# EAGLE schematic RS232Multiplexer (EAGLE 6.3)

## Sheet 1 of 4
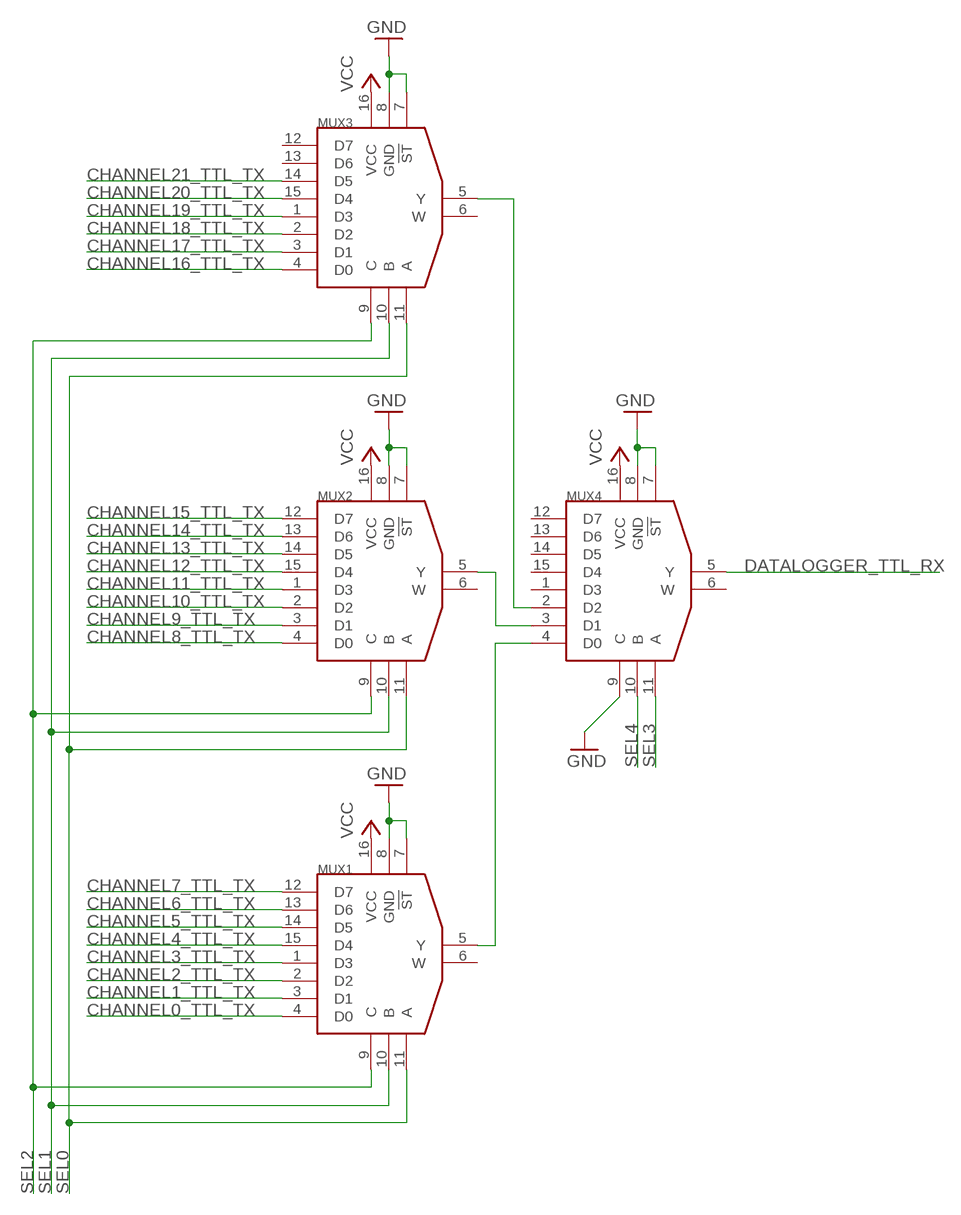
[diagram p0: schematic, sheet 1]

### Parts
MUX1  M74HC251_MULTIPLEXER  [GENERIC16]
MUX2  M74HC251_MULTIPLEXER  [GENERIC16]
MUX3  M74HC251_MULTIPLEXER  [GENERIC16]
MUX4  M74HC251_MULTIPLEXER  [GENERIC16]

### Nets
CHANNEL0_TTL_TX: MUX1.4(D0) ; also sheet 3
CHANNEL1_TTL_TX: MUX1.3(D1) ; also sheet 3
CHANNEL2_TTL_TX: MUX1.2(D2) ; also sheet 4
CHANNEL3_TTL_TX: MUX1.1(D3) ; also sheet 4
CHANNEL4_TTL_TX: MUX1.15(D4) ; also sheet 3
CHANNEL5_TTL_TX: MUX1.14(D5) ; also sheet 3
CHANNEL6_TTL_TX: MUX1.13(D6) ; also sheet 4
CHANNEL7_TTL_TX: MUX1.12(D7) ; also sheet 4
CHANNEL8_TTL_TX: MUX2.4(D0) ; also sheet 3
CHANNEL9_TTL_TX: MUX2.3(D1) ; also sheet 3
CHANNEL10_TTL_TX: MUX2.2(D2) ; also sheet 4
CHANNEL11_TTL_TX: MUX2.1(D3) ; also sheet 4
CHANNEL12_TTL_TX: MUX2.15(D4) ; also sheet 3
CHANNEL13_TTL_TX: MUX2.14(D5) ; also sheet 3
CHANNEL14_TTL_TX: MUX2.13(D6) ; also sheet 4
CHANNEL15_TTL_TX: MUX2.12(D7) ; also sheet 4
CHANNEL16_TTL_TX: MUX3.4(D0) ; also sheet 3
CHANNEL17_TTL_TX: MUX3.3(D1) ; also sheet 3
CHANNEL18_TTL_TX: MUX3.2(D2) ; also sheet 4
CHANNEL19_TTL_TX: MUX3.1(D3) ; also sheet 4
CHANNEL20_TTL_TX: MUX3.15(D4) ; also sheet 3
CHANNEL21_TTL_TX: MUX3.14(D5) ; also sheet 3
DATALOGGER_TTL_RX: MUX4.5(Y) ; also sheet 4
GND: MUX1.7(!ST) MUX1.8(GND) MUX2.7(!ST) MUX2.8(GND) MUX3.7(!ST) MUX3.8(GND) MUX4.7(!ST) MUX4.8(GND) MUX4.9(C) ; also sheet 2,3,4
N$1: MUX2.5(Y) MUX4.3(D1)
N$2: MUX3.5(Y) MUX4.2(D2)
N$10: MUX1.5(Y) MUX4.4(D0)
SEL0: MUX1.11(A) MUX2.11(A) MUX3.11(A) ; also sheet 2
SEL1: MUX1.10(B) MUX2.10(B) MUX3.10(B) ; also sheet 2
SEL2: MUX1.9(C) MUX2.9(C) MUX3.9(C) ; also sheet 2
SEL3: MUX4.11(A) ; also sheet 2
SEL4: MUX4.10(B) ; also sheet 2
VCC: MUX1.16(VCC) MUX2.16(VCC) MUX3.16(VCC) MUX4.16(VCC) ; also sheet 2,3,4
Unconnected: MUX1.6(W) MUX2.6(W) MUX3.6(W) MUX3.12(D7) MUX3.13(D6) MUX4.1(D3) MUX4.6(W) MUX4.12(D7) MUX4.13(D6) MUX4.14(D5) MUX4.15(D4)

## Sheet 2 of 4
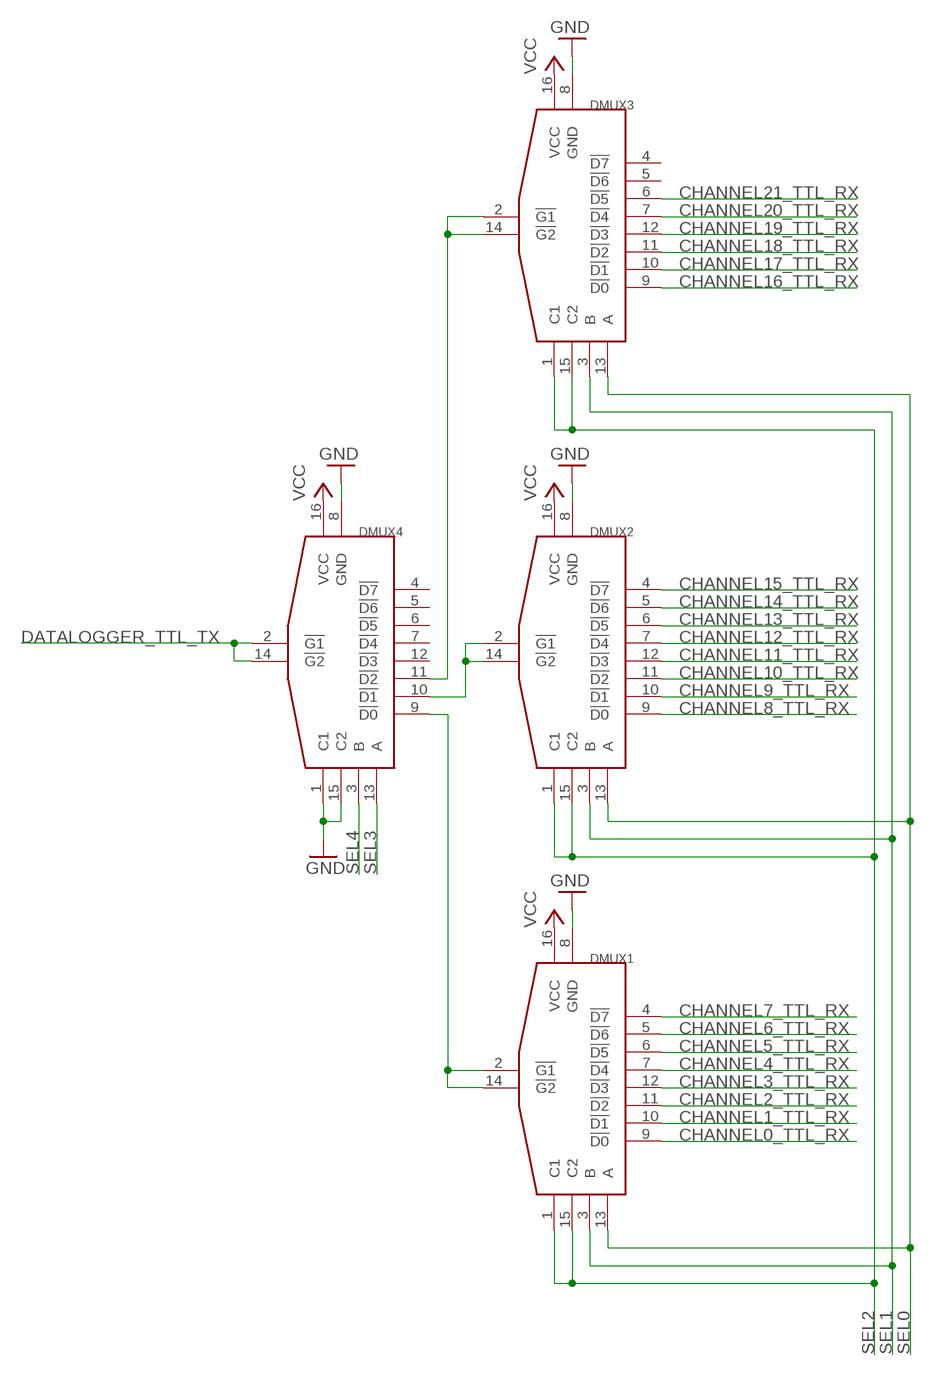
[diagram p1: schematic, sheet 2]

### Parts
DMUX1  SN74LS156_DEMULTIPLEXER  [GENERIC16]
DMUX2  SN74LS156_DEMULTIPLEXER  [GENERIC16]
DMUX3  SN74LS156_DEMULTIPLEXER  [GENERIC16]
DMUX4  SN74LS156_DEMULTIPLEXER  [GENERIC16]

### Nets
CHANNEL0_TTL_RX: DMUX1.9(!D0) ; also sheet 3
CHANNEL1_TTL_RX: DMUX1.10(!D1) ; also sheet 3
CHANNEL2_TTL_RX: DMUX1.11(!D2) ; also sheet 4
CHANNEL3_TTL_RX: DMUX1.12(!D3) ; also sheet 4
CHANNEL4_TTL_RX: DMUX1.7(!D4) ; also sheet 3
CHANNEL5_TTL_RX: DMUX1.6(!D5) ; also sheet 3
CHANNEL6_TTL_RX: DMUX1.5(!D6) ; also sheet 4
CHANNEL7_TTL_RX: DMUX1.4(!D7) ; also sheet 4
CHANNEL8_TTL_RX: DMUX2.9(!D0) ; also sheet 3
CHANNEL9_TTL_RX: DMUX2.10(!D1) ; also sheet 3
CHANNEL10_TTL_RX: DMUX2.11(!D2) ; also sheet 4
CHANNEL11_TTL_RX: DMUX2.12(!D3) ; also sheet 4
CHANNEL12_TTL_RX: DMUX2.7(!D4) ; also sheet 3
CHANNEL13_TTL_RX: DMUX2.6(!D5) ; also sheet 3
CHANNEL14_TTL_RX: DMUX2.5(!D6) ; also sheet 4
CHANNEL15_TTL_RX: DMUX2.4(!D7) ; also sheet 4
CHANNEL16_TTL_RX: DMUX3.9(!D0) ; also sheet 3
CHANNEL17_TTL_RX: DMUX3.10(!D1) ; also sheet 3
CHANNEL18_TTL_RX: DMUX3.11(!D2) ; also sheet 4
CHANNEL19_TTL_RX: DMUX3.12(!D3) ; also sheet 4
CHANNEL20_TTL_RX: DMUX3.7(!D4) ; also sheet 3
CHANNEL21_TTL_RX: DMUX3.6(!D5) ; also sheet 3
DATALOGGER_TTL_TX: DMUX4.2(!G1) DMUX4.14(!G2) ; also sheet 4
GND: DMUX1.8(GND) DMUX2.8(GND) DMUX3.8(GND) DMUX4.1(C1) DMUX4.8(GND) DMUX4.15(C2) ; also sheet 1,3,4
N$7: DMUX1.2(!G1) DMUX1.14(!G2) DMUX4.9(!D0)
N$9: DMUX2.2(!G1) DMUX2.14(!G2) DMUX4.10(!D1)
N$14: DMUX3.2(!G1) DMUX3.14(!G2) DMUX4.11(!D2)
SEL0: DMUX1.13(A) DMUX2.13(A) DMUX3.13(A) ; also sheet 1
SEL1: DMUX1.3(B) DMUX2.3(B) DMUX3.3(B) ; also sheet 1
SEL2: DMUX1.1(C1) DMUX1.15(C2) DMUX2.1(C1) DMUX2.15(C2) DMUX3.1(C1) DMUX3.15(C2) ; also sheet 1
SEL3: DMUX4.13(A) ; also sheet 1
SEL4: DMUX4.3(B) ; also sheet 1
VCC: DMUX1.16(VCC) DMUX2.16(VCC) DMUX3.16(VCC) DMUX4.16(VCC) ; also sheet 1,3,4
Unconnected: DMUX3.4(!D7) DMUX3.5(!D6) DMUX4.4(!D7) DMUX4.5(!D6) DMUX4.6(!D5) DMUX4.7(!D4) DMUX4.12(!D3)

## Sheet 3 of 4
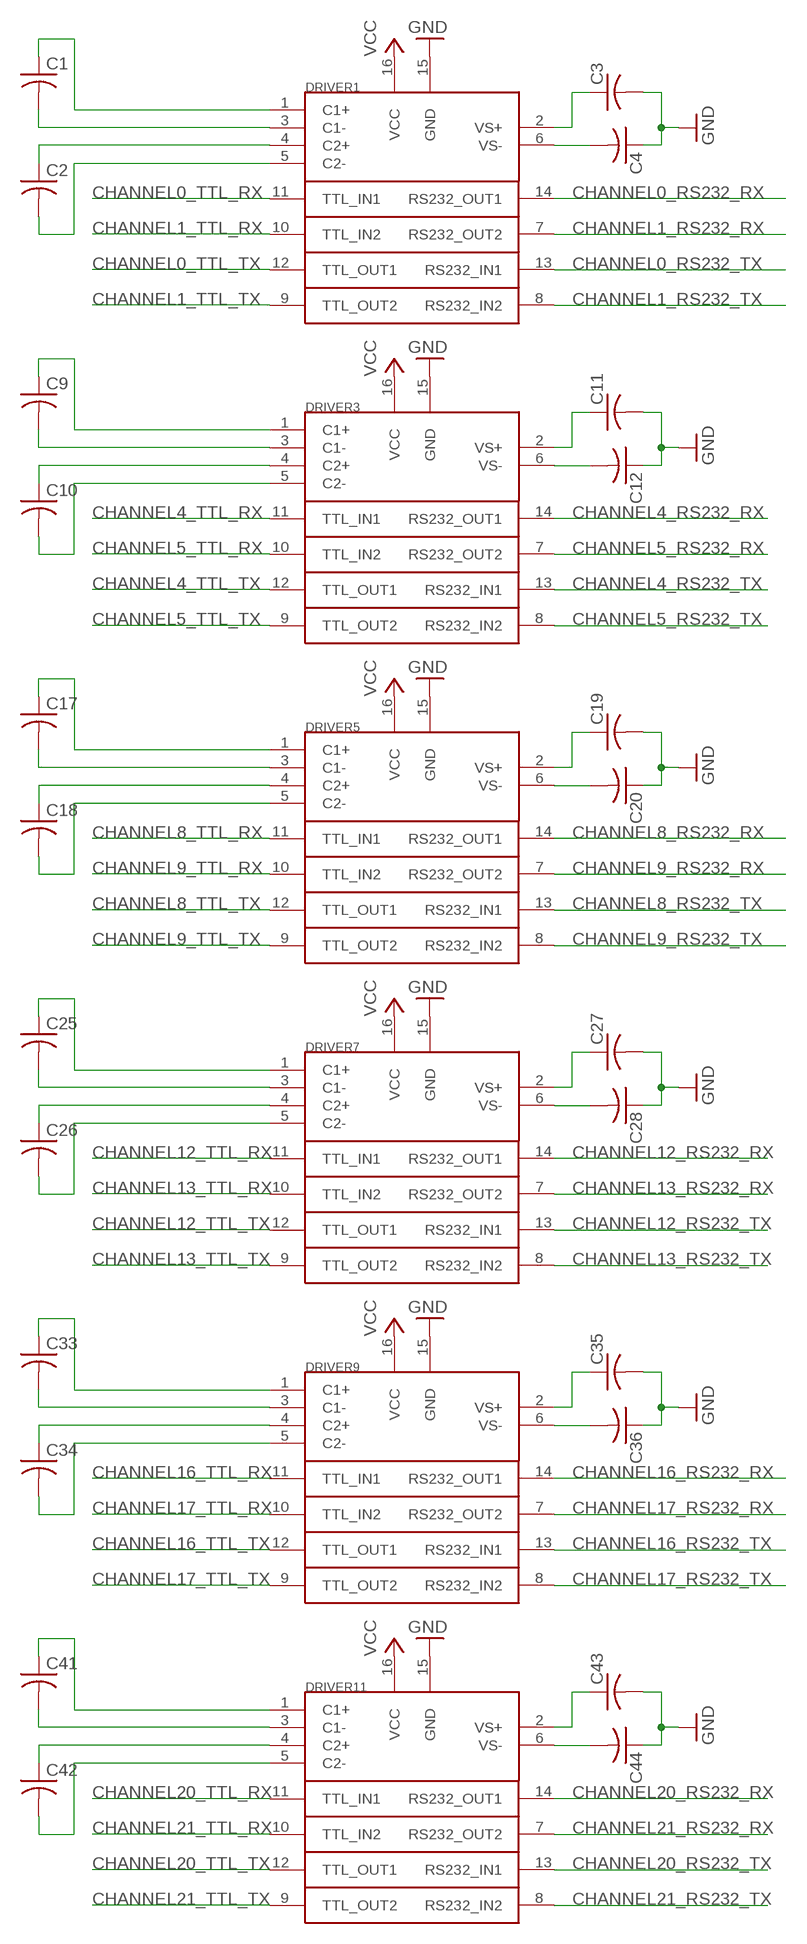
[diagram p2: schematic, sheet 3]

### Parts
C1  C-US025-024X044  [C025-024X044]
C2  C-US025-024X044  [C025-024X044]
C3  C-US025-024X044  [C025-024X044]
C4  C-US025-024X044  [C025-024X044]
C9  C-US025-024X044  [C025-024X044]
C10  C-US025-024X044  [C025-024X044]
C11  C-US025-024X044  [C025-024X044]
C12  C-US025-024X044  [C025-024X044]
C17  C-US025-024X044  [C025-024X044]
C18  C-US025-024X044  [C025-024X044]
C19  C-US025-024X044  [C025-024X044]
C20  C-US025-024X044  [C025-024X044]
C25  C-US025-024X044  [C025-024X044]
C26  C-US025-024X044  [C025-024X044]
C27  C-US025-024X044  [C025-024X044]
C28  C-US025-024X044  [C025-024X044]
C33  C-US025-024X044  [C025-024X044]
C34  C-US025-024X044  [C025-024X044]
C35  C-US025-024X044  [C025-024X044]
C36  C-US025-024X044  [C025-024X044]
C41  C-US025-024X044  [C025-024X044]
C42  C-US025-024X044  [C025-024X044]
C43  C-US025-024X044  [C025-024X044]
C44  C-US025-024X044  [C025-024X044]
DRIVER1  MAX232_DUALEIA232DRIVER  [GENERIC16]
DRIVER3  MAX232_DUALEIA232DRIVER  [GENERIC16]
DRIVER5  MAX232_DUALEIA232DRIVER  [GENERIC16]
DRIVER7  MAX232_DUALEIA232DRIVER  [GENERIC16]
DRIVER9  MAX232_DUALEIA232DRIVER  [GENERIC16]
DRIVER11  MAX232_DUALEIA232DRIVER  [GENERIC16]

### Nets
CHANNEL0_RS232_RX: DRIVER1.14(RS232_OUT1)
CHANNEL0_RS232_TX: DRIVER1.13(RS232_IN1)
CHANNEL0_TTL_RX: DRIVER1.11(TTL_IN1) ; also sheet 2
CHANNEL0_TTL_TX: DRIVER1.12(TTL_OUT1) ; also sheet 1
CHANNEL1_RS232_RX: DRIVER1.7(RS232_OUT2)
CHANNEL1_RS232_TX: DRIVER1.8(RS232_IN2)
CHANNEL1_TTL_RX: DRIVER1.10(TTL_IN2) ; also sheet 2
CHANNEL1_TTL_TX: DRIVER1.9(TTL_OUT2) ; also sheet 1
CHANNEL4_RS232_RX: DRIVER3.14(RS232_OUT1)
CHANNEL4_RS232_TX: DRIVER3.13(RS232_IN1)
CHANNEL4_TTL_RX: DRIVER3.11(TTL_IN1) ; also sheet 2
CHANNEL4_TTL_TX: DRIVER3.12(TTL_OUT1) ; also sheet 1
CHANNEL5_RS232_RX: DRIVER3.7(RS232_OUT2)
CHANNEL5_RS232_TX: DRIVER3.8(RS232_IN2)
CHANNEL5_TTL_RX: DRIVER3.10(TTL_IN2) ; also sheet 2
CHANNEL5_TTL_TX: DRIVER3.9(TTL_OUT2) ; also sheet 1
CHANNEL8_RS232_RX: DRIVER5.14(RS232_OUT1)
CHANNEL8_RS232_TX: DRIVER5.13(RS232_IN1)
CHANNEL8_TTL_RX: DRIVER5.11(TTL_IN1) ; also sheet 2
CHANNEL8_TTL_TX: DRIVER5.12(TTL_OUT1) ; also sheet 1
CHANNEL9_RS232_RX: DRIVER5.7(RS232_OUT2)
CHANNEL9_RS232_TX: DRIVER5.8(RS232_IN2)
CHANNEL9_TTL_RX: DRIVER5.10(TTL_IN2) ; also sheet 2
CHANNEL9_TTL_TX: DRIVER5.9(TTL_OUT2) ; also sheet 1
CHANNEL12_RS232_RX: DRIVER7.14(RS232_OUT1)
CHANNEL12_RS232_TX: DRIVER7.13(RS232_IN1)
CHANNEL12_TTL_RX: DRIVER7.11(TTL_IN1) ; also sheet 2
CHANNEL12_TTL_TX: DRIVER7.12(TTL_OUT1) ; also sheet 1
CHANNEL13_RS232_RX: DRIVER7.7(RS232_OUT2)
CHANNEL13_RS232_TX: DRIVER7.8(RS232_IN2)
CHANNEL13_TTL_RX: DRIVER7.10(TTL_IN2) ; also sheet 2
CHANNEL13_TTL_TX: DRIVER7.9(TTL_OUT2) ; also sheet 1
CHANNEL16_RS232_RX: DRIVER9.14(RS232_OUT1)
CHANNEL16_RS232_TX: DRIVER9.13(RS232_IN1)
CHANNEL16_TTL_RX: DRIVER9.11(TTL_IN1) ; also sheet 2
CHANNEL16_TTL_TX: DRIVER9.12(TTL_OUT1) ; also sheet 1
CHANNEL17_RS232_RX: DRIVER9.7(RS232_OUT2)
CHANNEL17_RS232_TX: DRIVER9.8(RS232_IN2)
CHANNEL17_TTL_RX: DRIVER9.10(TTL_IN2) ; also sheet 2
CHANNEL17_TTL_TX: DRIVER9.9(TTL_OUT2) ; also sheet 1
CHANNEL20_RS232_RX: DRIVER11.14(RS232_OUT1)
CHANNEL20_RS232_TX: DRIVER11.13(RS232_IN1)
CHANNEL20_TTL_RX: DRIVER11.11(TTL_IN1) ; also sheet 2
CHANNEL20_TTL_TX: DRIVER11.12(TTL_OUT1) ; also sheet 1
CHANNEL21_RS232_RX: DRIVER11.7(RS232_OUT2)
CHANNEL21_RS232_TX: DRIVER11.8(RS232_IN2)
CHANNEL21_TTL_RX: DRIVER11.10(TTL_IN2) ; also sheet 2
CHANNEL21_TTL_TX: DRIVER11.9(TTL_OUT2) ; also sheet 1
GND: C3.2 C4.1 C11.2 C12.1 C19.2 C20.1 C27.2 C28.1 C35.2 C36.1 C43.2 C44.1 DRIVER1.15(GND) DRIVER3.15(GND) DRIVER5.15(GND) DRIVER7.15(GND) DRIVER9.15(GND) DRIVER11.15(GND) ; also sheet 1,2,4
N$3: C2.1 DRIVER1.4(C2+)
N$4: C1.2 DRIVER1.3(C1-)
N$5: C2.2 DRIVER1.5(C2-)
N$6: C1.1 DRIVER1.1(C1+)
N$8: C3.1 DRIVER1.2(VS+)
N$11: C4.2 DRIVER1.6(VS-)
N$19: C10.1 DRIVER3.4(C2+)
N$20: C10.2 DRIVER3.5(C2-)
N$21: C9.2 DRIVER3.3(C1-)
N$22: C9.1 DRIVER3.1(C1+)
N$23: C11.1 DRIVER3.2(VS+)
N$24: C12.2 DRIVER3.6(VS-)
N$31: C18.1 DRIVER5.4(C2+)
N$32: C18.2 DRIVER5.5(C2-)
N$33: C17.2 DRIVER5.3(C1-)
N$34: C17.1 DRIVER5.1(C1+)
N$35: C19.1 DRIVER5.2(VS+)
N$36: C20.2 DRIVER5.6(VS-)
N$43: C26.1 DRIVER7.4(C2+)
N$44: C26.2 DRIVER7.5(C2-)
N$45: C25.2 DRIVER7.3(C1-)
N$46: C25.1 DRIVER7.1(C1+)
N$47: C27.1 DRIVER7.2(VS+)
N$48: C28.2 DRIVER7.6(VS-)
N$55: C34.1 DRIVER9.4(C2+)
N$56: C34.2 DRIVER9.5(C2-)
N$57: C33.2 DRIVER9.3(C1-)
N$58: C33.1 DRIVER9.1(C1+)
N$59: C35.1 DRIVER9.2(VS+)
N$60: C36.2 DRIVER9.6(VS-)
N$67: C42.1 DRIVER11.4(C2+)
N$68: C42.2 DRIVER11.5(C2-)
N$69: C41.2 DRIVER11.3(C1-)
N$70: C41.1 DRIVER11.1(C1+)
N$71: C43.1 DRIVER11.2(VS+)
N$72: C44.2 DRIVER11.6(VS-)
VCC: DRIVER1.16(VCC) DRIVER3.16(VCC) DRIVER5.16(VCC) DRIVER7.16(VCC) DRIVER9.16(VCC) DRIVER11.16(VCC) ; also sheet 1,2,4

## Sheet 4 of 4
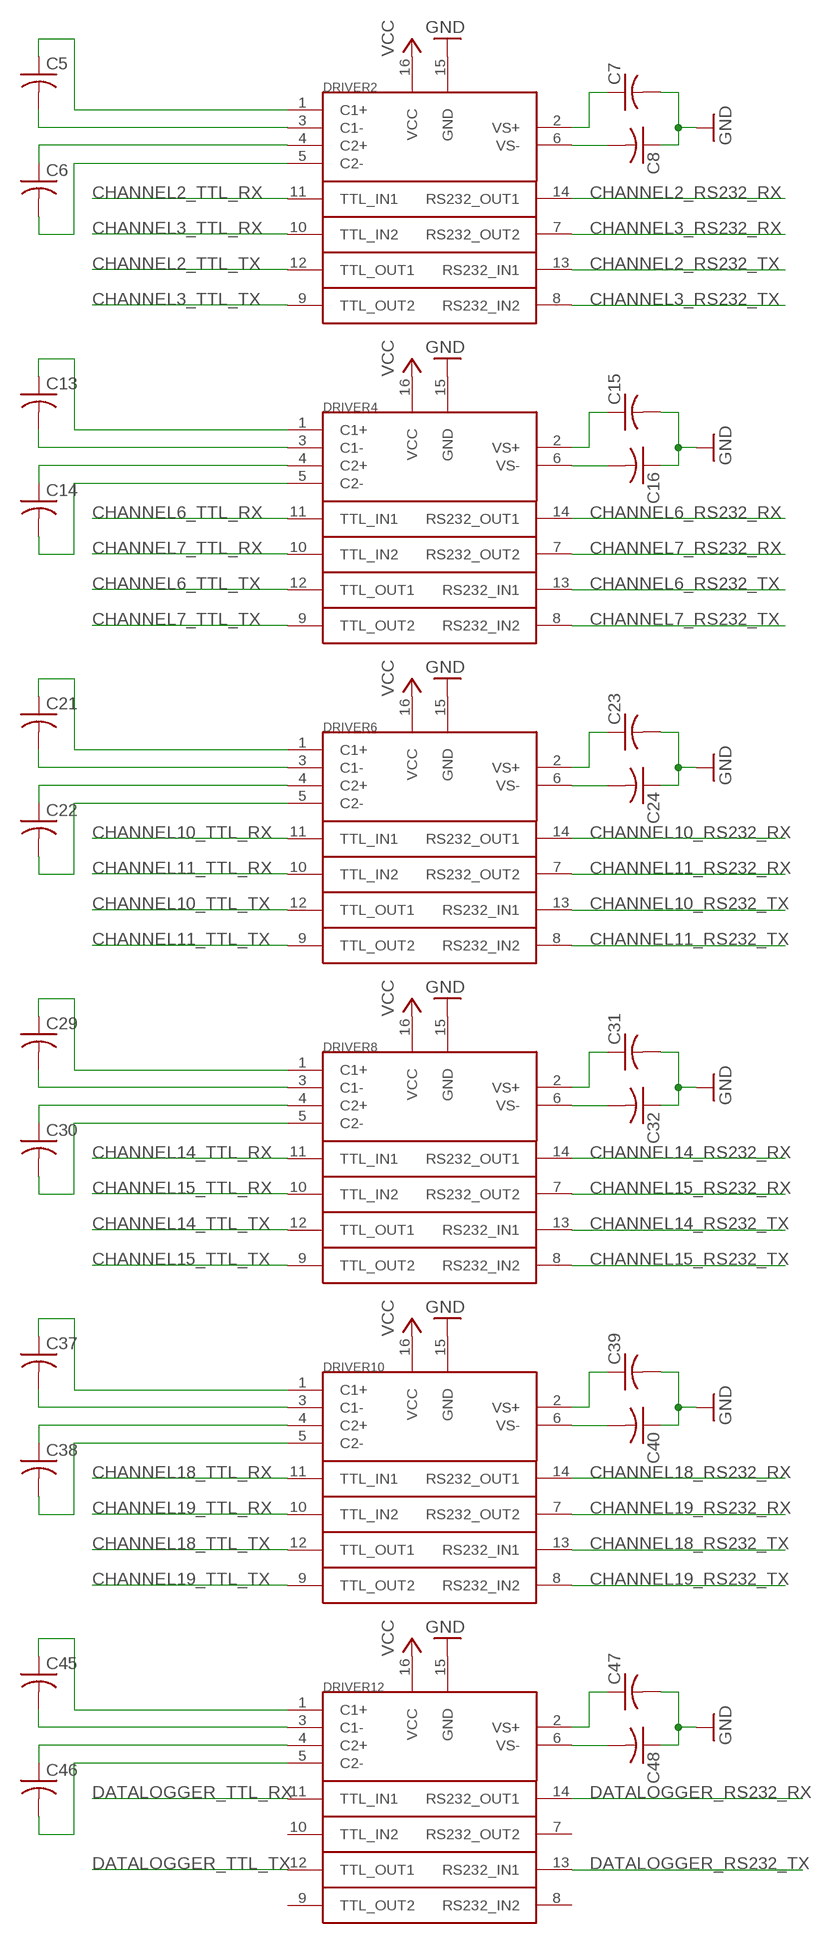
[diagram p3: schematic, sheet 4]

### Parts
C5  C-US025-024X044  [C025-024X044]
C6  C-US025-024X044  [C025-024X044]
C7  C-US025-024X044  [C025-024X044]
C8  C-US025-024X044  [C025-024X044]
C13  C-US025-024X044  [C025-024X044]
C14  C-US025-024X044  [C025-024X044]
C15  C-US025-024X044  [C025-024X044]
C16  C-US025-024X044  [C025-024X044]
C21  C-US025-024X044  [C025-024X044]
C22  C-US025-024X044  [C025-024X044]
C23  C-US025-024X044  [C025-024X044]
C24  C-US025-024X044  [C025-024X044]
C29  C-US025-024X044  [C025-024X044]
C30  C-US025-024X044  [C025-024X044]
C31  C-US025-024X044  [C025-024X044]
C32  C-US025-024X044  [C025-024X044]
C37  C-US025-024X044  [C025-024X044]
C38  C-US025-024X044  [C025-024X044]
C39  C-US025-024X044  [C025-024X044]
C40  C-US025-024X044  [C025-024X044]
C45  C-US025-024X044  [C025-024X044]
C46  C-US025-024X044  [C025-024X044]
C47  C-US025-024X044  [C025-024X044]
C48  C-US025-024X044  [C025-024X044]
DRIVER2  MAX232_DUALEIA232DRIVER  [GENERIC16]
DRIVER4  MAX232_DUALEIA232DRIVER  [GENERIC16]
DRIVER6  MAX232_DUALEIA232DRIVER  [GENERIC16]
DRIVER8  MAX232_DUALEIA232DRIVER  [GENERIC16]
DRIVER10  MAX232_DUALEIA232DRIVER  [GENERIC16]
DRIVER12  MAX232_DUALEIA232DRIVER  [GENERIC16]

### Nets
CHANNEL2_RS232_RX: DRIVER2.14(RS232_OUT1)
CHANNEL2_RS232_TX: DRIVER2.13(RS232_IN1)
CHANNEL2_TTL_RX: DRIVER2.11(TTL_IN1) ; also sheet 2
CHANNEL2_TTL_TX: DRIVER2.12(TTL_OUT1) ; also sheet 1
CHANNEL3_RS232_RX: DRIVER2.7(RS232_OUT2)
CHANNEL3_RS232_TX: DRIVER2.8(RS232_IN2)
CHANNEL3_TTL_RX: DRIVER2.10(TTL_IN2) ; also sheet 2
CHANNEL3_TTL_TX: DRIVER2.9(TTL_OUT2) ; also sheet 1
CHANNEL6_RS232_RX: DRIVER4.14(RS232_OUT1)
CHANNEL6_RS232_TX: DRIVER4.13(RS232_IN1)
CHANNEL6_TTL_RX: DRIVER4.11(TTL_IN1) ; also sheet 2
CHANNEL6_TTL_TX: DRIVER4.12(TTL_OUT1) ; also sheet 1
CHANNEL7_RS232_RX: DRIVER4.7(RS232_OUT2)
CHANNEL7_RS232_TX: DRIVER4.8(RS232_IN2)
CHANNEL7_TTL_RX: DRIVER4.10(TTL_IN2) ; also sheet 2
CHANNEL7_TTL_TX: DRIVER4.9(TTL_OUT2) ; also sheet 1
CHANNEL10_RS232_RX: DRIVER6.14(RS232_OUT1)
CHANNEL10_RS232_TX: DRIVER6.13(RS232_IN1)
CHANNEL10_TTL_RX: DRIVER6.11(TTL_IN1) ; also sheet 2
CHANNEL10_TTL_TX: DRIVER6.12(TTL_OUT1) ; also sheet 1
CHANNEL11_RS232_RX: DRIVER6.7(RS232_OUT2)
CHANNEL11_RS232_TX: DRIVER6.8(RS232_IN2)
CHANNEL11_TTL_RX: DRIVER6.10(TTL_IN2) ; also sheet 2
CHANNEL11_TTL_TX: DRIVER6.9(TTL_OUT2) ; also sheet 1
CHANNEL14_RS232_RX: DRIVER8.14(RS232_OUT1)
CHANNEL14_RS232_TX: DRIVER8.13(RS232_IN1)
CHANNEL14_TTL_RX: DRIVER8.11(TTL_IN1) ; also sheet 2
CHANNEL14_TTL_TX: DRIVER8.12(TTL_OUT1) ; also sheet 1
CHANNEL15_RS232_RX: DRIVER8.7(RS232_OUT2)
CHANNEL15_RS232_TX: DRIVER8.8(RS232_IN2)
CHANNEL15_TTL_RX: DRIVER8.10(TTL_IN2) ; also sheet 2
CHANNEL15_TTL_TX: DRIVER8.9(TTL_OUT2) ; also sheet 1
CHANNEL18_RS232_RX: DRIVER10.14(RS232_OUT1)
CHANNEL18_RS232_TX: DRIVER10.13(RS232_IN1)
CHANNEL18_TTL_RX: DRIVER10.11(TTL_IN1) ; also sheet 2
CHANNEL18_TTL_TX: DRIVER10.12(TTL_OUT1) ; also sheet 1
CHANNEL19_RS232_RX: DRIVER10.7(RS232_OUT2)
CHANNEL19_RS232_TX: DRIVER10.8(RS232_IN2)
CHANNEL19_TTL_RX: DRIVER10.10(TTL_IN2) ; also sheet 2
CHANNEL19_TTL_TX: DRIVER10.9(TTL_OUT2) ; also sheet 1
DATALOGGER_RS232_RX: DRIVER12.14(RS232_OUT1)
DATALOGGER_RS232_TX: DRIVER12.13(RS232_IN1)
DATALOGGER_TTL_RX: DRIVER12.11(TTL_IN1) ; also sheet 1
DATALOGGER_TTL_TX: DRIVER12.12(TTL_OUT1) ; also sheet 2
GND: C7.2 C8.1 C15.2 C16.1 C23.2 C24.1 C31.2 C32.1 C39.2 C40.1 C47.2 C48.1 DRIVER2.15(GND) DRIVER4.15(GND) DRIVER6.15(GND) DRIVER8.15(GND) DRIVER10.15(GND) DRIVER12.15(GND) ; also sheet 1,2,3
N$12: C6.1 DRIVER2.4(C2+)
N$13: C6.2 DRIVER2.5(C2-)
N$15: C5.2 DRIVER2.3(C1-)
N$16: C5.1 DRIVER2.1(C1+)
N$17: C7.1 DRIVER2.2(VS+)
N$18: C8.2 DRIVER2.6(VS-)
N$25: C14.1 DRIVER4.4(C2+)
N$26: C14.2 DRIVER4.5(C2-)
N$27: C13.2 DRIVER4.3(C1-)
N$28: C13.1 DRIVER4.1(C1+)
N$29: C15.1 DRIVER4.2(VS+)
N$30: C16.2 DRIVER4.6(VS-)
N$37: C22.1 DRIVER6.4(C2+)
N$38: C22.2 DRIVER6.5(C2-)
N$39: C21.2 DRIVER6.3(C1-)
N$40: C21.1 DRIVER6.1(C1+)
N$41: C23.1 DRIVER6.2(VS+)
N$42: C24.2 DRIVER6.6(VS-)
N$49: C30.1 DRIVER8.4(C2+)
N$50: C30.2 DRIVER8.5(C2-)
N$51: C29.2 DRIVER8.3(C1-)
N$52: C29.1 DRIVER8.1(C1+)
N$53: C31.1 DRIVER8.2(VS+)
N$54: C32.2 DRIVER8.6(VS-)
N$61: C38.1 DRIVER10.4(C2+)
N$62: C38.2 DRIVER10.5(C2-)
N$63: C37.2 DRIVER10.3(C1-)
N$64: C37.1 DRIVER10.1(C1+)
N$65: C39.1 DRIVER10.2(VS+)
N$66: C40.2 DRIVER10.6(VS-)
N$73: C46.1 DRIVER12.4(C2+)
N$74: C46.2 DRIVER12.5(C2-)
N$75: C45.2 DRIVER12.3(C1-)
N$76: C45.1 DRIVER12.1(C1+)
N$77: C47.1 DRIVER12.2(VS+)
N$78: C48.2 DRIVER12.6(VS-)
VCC: DRIVER2.16(VCC) DRIVER4.16(VCC) DRIVER6.16(VCC) DRIVER8.16(VCC) DRIVER10.16(VCC) DRIVER12.16(VCC) ; also sheet 1,2,3
Unconnected: DRIVER12.7(RS232_OUT2) DRIVER12.8(RS232_IN2) DRIVER12.9(TTL_OUT2) DRIVER12.10(TTL_IN2)

## Library data of the parts
C1-C48 = resistor:C-US: CAPACITOR, American symbol
DMUX1-DMUX4 = RS232Multiplexer:SN74LS156_DEMULTIPLEXER
DRIVER1-DRIVER12 = RS232Multiplexer:MAX232_DUALEIA232DRIVER
MUX1-MUX4 = RS232Multiplexer:M74HC251_MULTIPLEXER